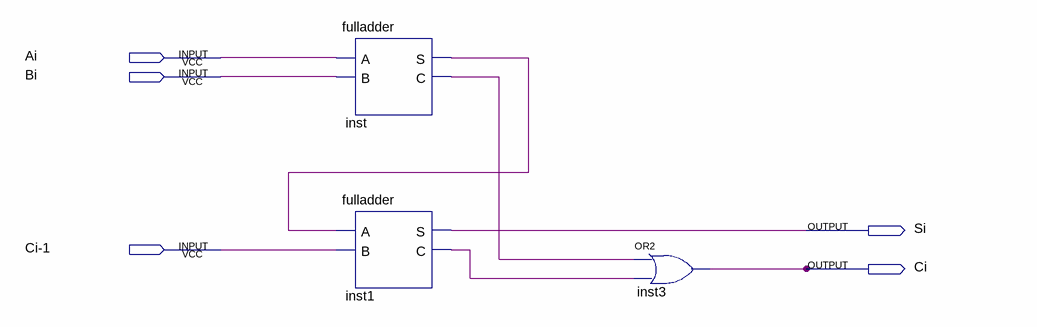
[diagram p0: schematic sheet]
// Quartus schematic adder1.bdf as structural Verilog: 3 symbols, 5 pins
module adder1 (
  input  Ai,
  input  Bi,
  input  \Ci-1 ,
  output Si,
  output Ci
);

  wire inst1_c, inst_c, inst_s;

  fulladder inst (.A(Ai), .B(Bi), .S(inst_s), .C(inst_c));
  fulladder inst1 (.A(inst_s), .B(\Ci-1 ), .S(Si), .C(inst1_c));
  or inst3 (Ci, inst_c, inst1_c);
endmodule
